# EasyEDA Pro project 小相机第一版.epro

# Schematic Schematic1
Assembly Variant: Basic; Board Name: Board1; Create Date: 2025-12-20; Page Name: P1; Project Name: 摄像头屏幕模块; Schematic Name: Schematic1; Update Date: 2025-12-20; BladeWidth: 10; Company: 嘉立创EDA; Page Size: A4; RegionStart: 1; ShowBorder: 1; TitleBlock: 1; TitleBlockPosition: 3; Version: V1.0; XRegionCount: 6; YRegionCount: 4
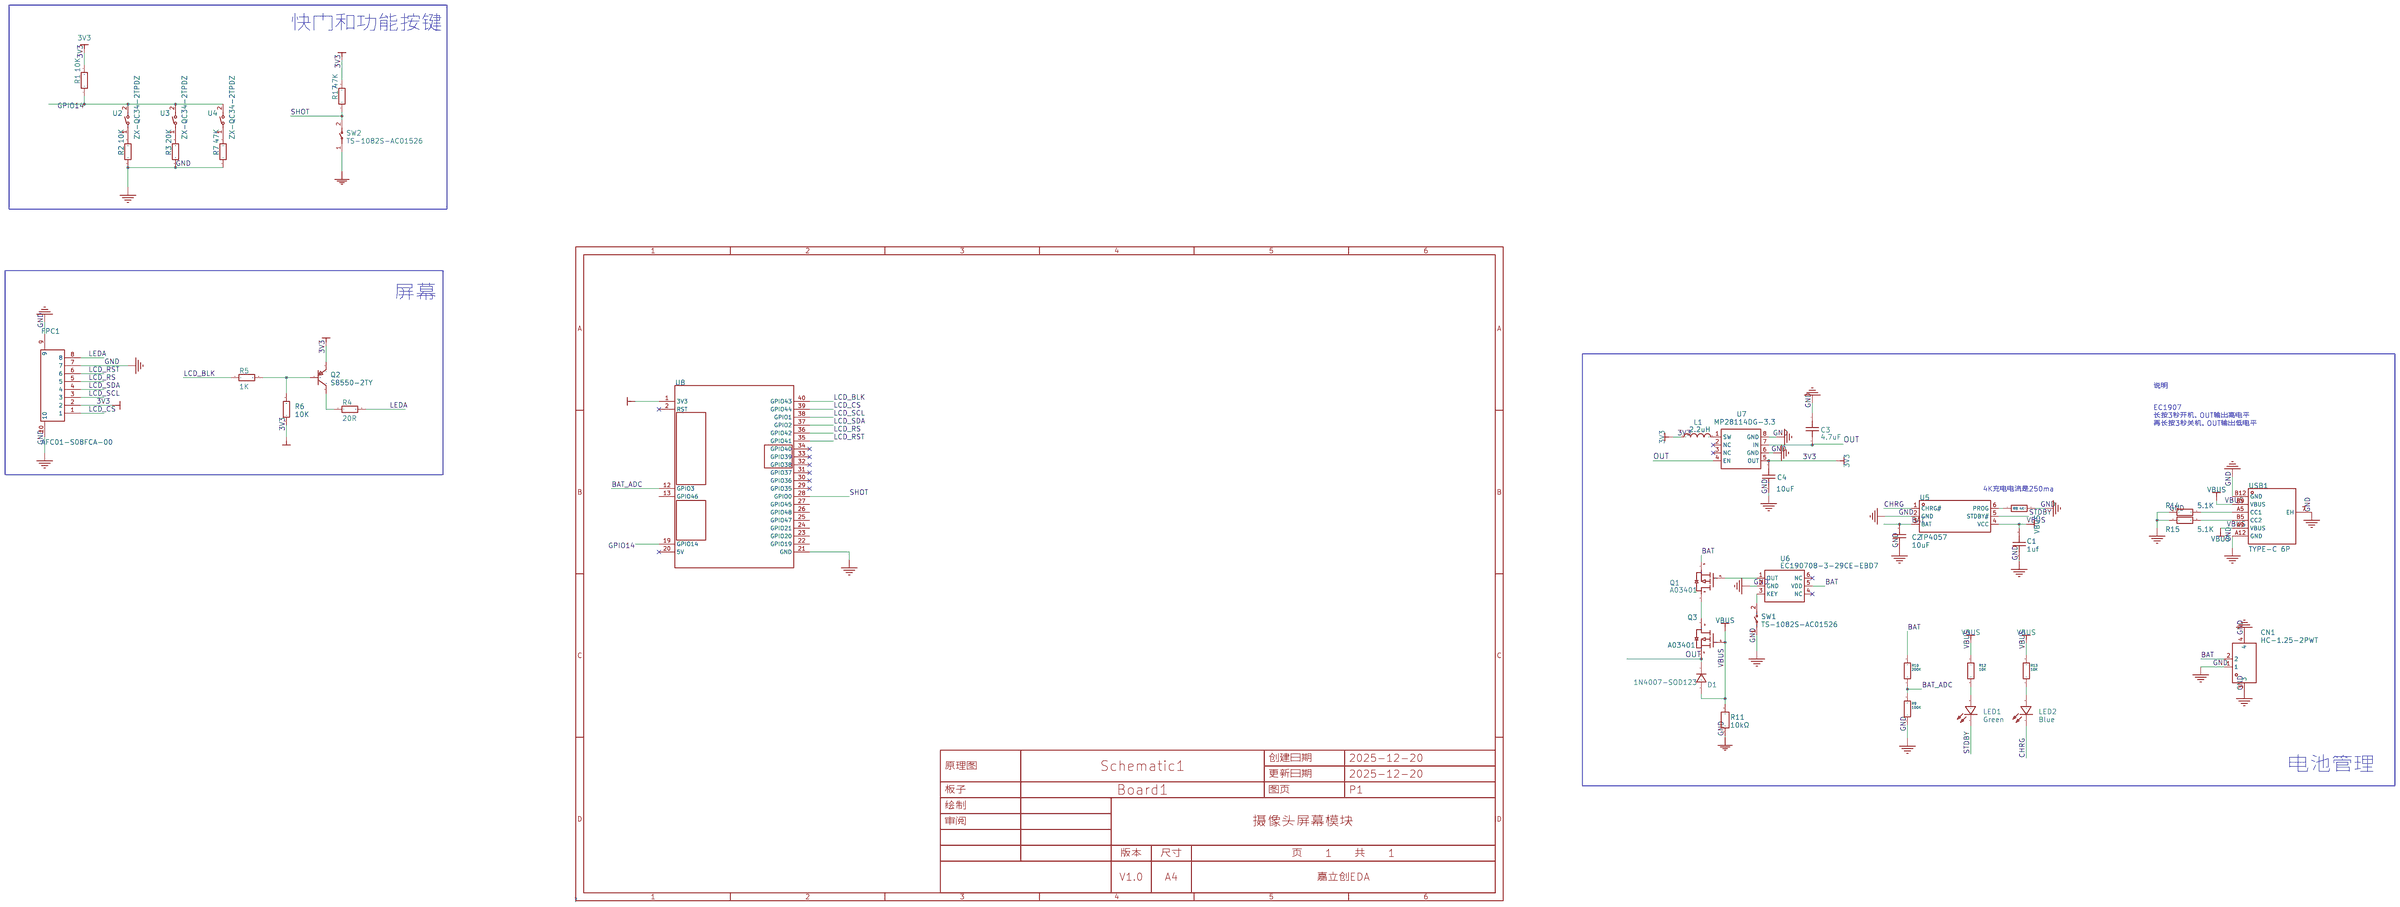
[diagram p0: schematic sheet]

## Parts
C1  1uf  [C0402]
C2  10uF  [C0402]
C3  4.7uF  [C0402]
C4  10uF  [C0402]
CN1  HC-1.25-2PWT  [CONN-SMD_2P-P1.25-HC-1.25-2PWT]
D1  1N4007-SOD123  [SOD-123FL_L2.8-W1.8-LS3.7-RD-1]
FPC1  AFC01-S08FCA-00  [FPC-SMD_P0.50-8P_FGS-XJ-H2.0]
L1  2.2uH  [L0402]
LED1  Green  [LED0603-RD]
LED2  Blue  [LED0603-RD]
Q1  A03401  [A03401]
Q2  S8550-2TY  [SOT-23-3_L2.9-W1.3-P0.95-LS2.4-BR]
Q3  A03401  [A03401]
R1  10K  [R0402]
R2  10K  [R0402]
R3  20K  [R0402]
R4  20R  [R0402]
R5  1K  [R0402]
R6  10K  [R0402]
R7  47K  [R0402]
R8  4K  [R0402]
R9  100K  [R0402]
R10  200K  [R0402]
R11  10kΩ  [R0402]
R12  10K  [R0402]
R13  10K  [R0402]
R14  5.1K  [R0402]
R15  5.1K  [R0402]
R17  47K  [R0402]
SW1  TS-1082S-AC01526  [SW-SMD_L3.9-W3.6-LS4.8-EH]
SW2  TS-1082S-AC01526  [SW-SMD_L3.9-W3.6-LS4.8-EH]
U2  ZX-QC34-2TPDZ  [KEY-SMD_L3.9-W3.0-LS5.0-EH]
U3  ZX-QC34-2TPDZ  [KEY-SMD_L3.9-W3.0-LS5.0-EH]
U4  ZX-QC34-2TPDZ  [KEY-SMD_L3.9-W3.0-LS5.0-EH]
U5  TP4057  [SOT-23-6_L2.9-W1.6-P0.95-LS2.8-BR]
U6  EC190708-3-29CE-EBD7  [SOT-23-6_L2.9-W1.6-P0.95-LS2.9-BL]
U7  MP28114DG-3.3  [MP28114DG-3.3]
U8  -  [esp32s3_cam模块]
USB1  TYPE-C 6P  [TYPE-C-SMD_TYPE-C-6P]

## Library data of the parts
C1 = CAP_0603: Supplier Footprint: 0603
C2 = CL05A106MQ5NUNC: 容值:10uF;精度:±20%;额定电压:6.3V;温度系数:X5R;; LCSC Part Name: 10uF ±20% 6.3V; Supplier Part: C15525; Manufacturer: SAMSUNG(三星); Supplier Footprint: 0402; JLCPCB Part Class: Basic Part; Datasheet: https://item.szlcsc.com/datasheet/CL05A106MQ5NUNC/16204.html; Supplier: LCSC; Tolerance: ±20%; Voltage Rating: 6.3V; Temperature Coefficient: X5R
C3 = 4.7uF: Supplier: LCSC; Supplier Part: C15415; Manufacturer: SAMSUNG(三星); Manufacturer Part: 1uF; JLCPCB Part Class: Extended Part; nameAlias: Value; Contributor: LCSC; spicePre: C; spiceSymbolName: 10UF
C4 = 10uF: Supplier: LCSC; Supplier Part: C15415; Manufacturer: SAMSUNG(三星); JLCPCB Part Class: Extended Part; nameAlias: Value; Contributor: LCSC; spicePre: C; spiceSymbolName: 10UF
CN1 = HC-1.25-2PWT: 插针结构:1x2P;间距:1.25mm;安装方式:卧贴;参考系列:PicoBlade(MX 1.25);总PIN数:2P;排数:1;每排PIN数:2;行距:-;额定电流:1A;触头材质:黄铜;触头镀层:锡;工作温度范围:-40℃~+105℃;; LCSC Part Name: 1x2P 间距:1.25mm 卧贴 系列:PicoBlade(MX 1.25); Supplier Part: C2845379; Manufacturer: HCTL(华灿天禄); Supplier Footprint: SMD,P=1.25mm,卧贴; JLCPCB Part Class: Extended Part; Datasheet: https://atta.szlcsc.com/upload/public/pdf/source/20240930/9508A8292CCC87B0C29E3A028D56E30A.pdf; Supplier: LCSC; Pins Structure: 1x2P; Pitch: 1.25mm; Mounting Style: 卧贴; Reference Series: PicoBlade(MX 1.25); Number of Pins: 2P; Number of Rows: 1; Number of PINs Per Row: 2; Current Rating (Max): 1A; Contact Material: 黄铜; Contact Plating: 锡; Operating Temperature Range: -40℃~+105℃; Rated Voltage (Max): 125V; Plastic Material: LCP; Flame Retardant Rating: UL94V-0; Supplementary Features: 辅助焊脚; Z-Height of the Board: 3.57mm; X-Length of Bottom Edge on Board (Spacing Line): 7.55mm; Y-Width of Bottom Edge on Board: 5.25mm
D1 = 1N4007-SOD123: Supplier: LCSC; Supplier Part: C9900003500; Manufacturer: null; Contributor: LCSC; spicePre: D
FPC1 = AFC01-S08FCA-00: 锁定特性:翻盖式;触点类型:下接;触点数量:8P;间距:0.5mm;安装方式:卧贴;; LCSC Part Name: 间距:0.5mm P数:8P 翻盖式 下接; Supplier Part: C262657; Manufacturer: JS(钜硕电子); Supplier Footprint: SMD,P=0.5mm,卧贴; JLCPCB Part Class: Extended Part; Datasheet: https://item.szlcsc.com/datasheet/AFC01-S08FCA-00/253916.html; Supplier: LCSC; Locking Feature: 翻盖式; Contact Type: 下接; Number of Contacts: 8P; Pitch: 0.5mm; Mounting Type: 卧贴; FFC, FCB Thickness: 0.3mm; Height Above Board: 2mm
L1 = 2.2uH: Supplier: LCSC; Supplier Part: C5349665; Manufacturer: APV(爱普微); Manufacturer Part: APH0420T2R2M; JLCPCB Part Class: Extended Part; Contributor: lcsc; nameAlias: Value; spicePre: L; spiceSymbolName: APH0420T2R2M
LED1 LED2 = NCD0603Y2: 发光颜色:黄色;正向电压(VF):1.6V~2.6V;功率:65mW;正向电流:20mA;主波长:586nm~595nm;透镜颜色:无色透明透镜;发光强度:100mcd~220mcd;发光角度:130°;工作温度:-30℃~+85℃;; Supplier Part: C89811; Manufacturer: 国星光电; Supplier Footprint: 0603; JLCPCB Part Class: Extended Part; Datasheet: https://atta.szlcsc.com/upload/public/pdf/source/20200820/C89811_7FE84B429B6BCA3E113B125EE1452576.pdf; Supplier: LCSC; Emitted Color: 黄色; Forward Voltage (VF): 1.6V~2.6V; Power Dissipation: 65mW; Forward Current: 20mA; Dominant Wavelength: 586nm~595nm; Lens Color: 无色透明透镜; Luminous Intensity: 100mcd~220mcd; Viewing Angle: 130°; Operating Temperature: -30℃~+85℃
Q1 = A03401: Contributor: shanggan; spicePre: Q
Q2 = S8550-2TY: 晶体管类型:PNP;集电极电流(Ic):500mA;集射极击穿电压(Vceo):25V;耗散功率(Pd):300mW;直流电流增益(hFE):120@50mA,1V;; Supplier Part: C364313; Manufacturer: MDD(辰达半导体); Supplier Footprint: SOT-23; JLCPCB Part Class: Extended Part; Datasheet: https://atta.szlcsc.com/upload/public/pdf/source/20241121/929C91E9FE84DD82662DA9EB9CD21AEF.pdf; Supplier: LCSC; type: PNP; Current - Collector(Ic): 500mA; Collector - Emitter Voltage VCEO: 25V; Pd - Power Dissipation: 300mW; DC Current Gain: 120@50mA,1V; Transition frequency(fT): 150MHz; Current - Collector Cutoff: 100nA; Vce Saturation(VCE(sat)): 600mV; Operating Temperature: -55℃~+150℃
Q3 = A03401_1: Contributor: shanggan; spicePre: Q
R1-R3 R7 R17 = Res_0603: Supplier Footprint: 0603
R4-R6 R8-R10 R12-R15 = Res_604: Supplier Footprint: 0603
R11 = 10kΩ: Supplier: LCSC; Supplier Part: C6125857; Manufacturer: Ohmite; Manufacturer Part: APC0603T10K0Z; JLCPCB Part Class: Extended Part; nameAlias: Value; Contributor: lcsc; spicePre: R; spiceSymbolName: APC0603T10K0Z
SW1 SW2 = TS-1082S-AC01526: 电路结构:单刀单掷;按钮形状:矩形按钮;作用力:2.6N;安装方式:卧贴;开关长度:3.9mm;开关宽度:2.9mm;开关高度:1.5mm;带支架:带支架;触点电流:50mA;额定电压:12V;工作寿命:10万次;; LCSC Part Name: 3.9*2.9*1.5mm 卧贴 轻触开关; Supplier Part: C720494; Manufacturer: XUNPU(讯普); Supplier Footprint: SMD,3.9x2.9mm; JLCPCB Part Class: Extended Part; Datasheet: https://item.szlcsc.com/datasheet/TS-1082S-AC01526/763501.html; Supplier: LCSC; Circuit: 单刀单掷; Actuator Style: 矩形按钮; Operating Force: 2.6N; Mounting Type: 卧贴; Length: 3.9mm; Width: 2.9mm; Switch Height: 1.5mm; with Bracket: 带支架; Contact Current: 50mA; Voltage Rating: 12V; Actuator/Cap Color: 黑色; Termination Style: SMD接片; Life: 10万次; Operating Temperature: -30℃~+80℃
U2-U4 = ZX-QC34-2TPDZ: 电路结构:单刀单掷;按钮形状:圆形按钮;作用力:2.6N;安装方式:立贴;开关长度:3mm;开关宽度:4mm;开关高度:2mm;带支架:不带支架;触点电流:50mA;额定电压:12V;工作寿命:10万次;; LCSC Part Name: 3*4*2贴片开关带柱; Supplier Part: C7470219; Manufacturer: Megastar(兆星); Supplier Footprint: SMD,4x3mm; JLCPCB Part Class: Extended Part; Datasheet: https://item.szlcsc.com/datasheet/ZX-QC34-2TPDZ/8519225.html; Supplier: LCSC; Circuit: 单刀单掷; Actuator Style: 圆形按钮; Operating Force: 2.6N; Mounting Type: 立贴; Length: 3mm; Width: 4mm; Switch Height: 2mm; with Bracket: 不带支架; Contact Current: 50mA; Voltage Rating: 12V; Actuator/Cap Color: 黑色; Termination Style: 鸥翼型; Life: 10万次; Operating Temperature: -30℃~+80℃
U5 = TP4057: 工作电压:4V~6.5V;最大充电电流:500mA;电池类型:锂离子;电池节数:1;; Supplier Part: C725791; Manufacturer: UMW(友台半导体); Supplier Footprint: SOT-23-6; JLCPCB Part Class: Extended Part; Datasheet: https://item.szlcsc.com/datasheet/TP4057/772194.html; Supplier: LCSC; The Chip Type: 充电芯片; Voltage - Supply: 4V~6.5V; Charge Current - Max: 500mA; Charging Saturation Voltage: 4.24V; Type of Battery: 锂离子; Number of Cells: 1; Operating Temperature: -40℃~+85℃; Battery Temperature Detection: 支持; Supply Current (Iq): 25uA
U6 = EC190708-3-29CE-EBD7: Supplier: LCSC; Supplier Part: C9900183753; Manufacturer: null; Contributor: lcsc; spicePre: U
U7 = MP28114DG-3.3: Contributor: httppp; spicePre: U
U8 = esp32s3_cam模块
USB1 = TYPE-C 6P: 连接器类型:Type-C;标准:USB 3.1;公母:母;安装方式:卧贴;触点数量:6P;端口数量:1;额定电流 - 电源:5A;工作温度范围:-40℃~+85℃;; LCSC Part Name: Type-C 母 卧贴; Supplier Part: C456012; Manufacturer: SHOU HAN(首韩); Supplier Footprint: SMD; JLCPCB Part Class: Extended Part; Datasheet: https://atta.szlcsc.com/upload/public/pdf/source/20201203/C456012_B13F72044DF846EDBE9BDD0D1D3CD166.pdf; Supplier: LCSC; Connector Type: Type-C; Standard: USB 3.1; Gender: 母; Mounting Style: 卧贴; Number of Contacts: 6P; Number of Ports: 1; Current Rating - Power (Max): 5A; Operating Temperature Range: -40℃~+85℃; Rated Voltage (Max): 20V; Connect-Disconnect Life: 3千次; Core Colour: 黑色

## Nets
3V3: C4.1 FPC1.2 L1.1 Q2.2(E) R1.2 R6.1 R17.2 U7.5(OUT) U8.1(3V3)
GND: C1.1 C2.1 C3.1 C4.2 CN1.1 CN1.3 CN1.4 FPC1.7 FPC1.9 FPC1.10 R2.1 R3.1 R7.1 R8.2 R9.1 R11.1 R14.1 R15.1 SW1.1 SW2.1 U5.2(GND) U6.2(GND) U7.6(GND) U7.8(GND) U8.21(GND) USB1.7(EH) USB1.A12(GND) USB1.B12(GND)
VBUS: C1.2 D1.2 Q3.1(G) R11.2 R12.1 R13.2 U5.4(VCC) USB1.A9(VBUS) USB1.B9(VBUS)
BAT: C2.2 CN1.2 Q1.2(S) R10.2 U5.3(BAT) U6.5(VDD)
BAT_ADC: R9.2 R10.1 U8.12(GPIO3)
CHRG: LED2.1(K) U5.1(CHRG#)
GPIO14: R1.1 U2.2 U3.2 U4.2 U8.19(GPIO14)
LCD_BLK: R5.1 U8.40(GPIO43)
LCD_CS: FPC1.1 U8.39(GPIO44)
LCD_RS: FPC1.5 U8.36(GPIO42)
LCD_RST: FPC1.6 U8.35(GPIO41)
LCD_SCL: FPC1.3 U8.38(GPIO1)
LCD_SDA: FPC1.4 U8.37(GPIO2)
LEDA: FPC1.8 R4.2
OUT: C3.2 D1.1 Q3.2(S) U7.4(EN) U7.7(IN)
SHOT: R17.1 SW2.2 U8.28(GPIO0)
STDBY: LED1.1(K) U5.5(STDBY#)
$1N30: Q2.3(C) R4.1
$1N32: Q2.1(B) R5.2 R6.2
$1N51: R2.2 U2.1
$1N52: R3.2 U3.1
$1N53: R7.2 U4.1
$1N119: R15.2 USB1.B5(CC2)
$1N120: R14.2 USB1.A5(CC1)
$1N124: LED2.2(A) R13.1
$1N126: LED1.2(A) R12.2
$1N130: Q1.3(D) Q3.3(D)
$1N146: SW1.2 U6.3(KEY)
$1N149: Q1.1(G) U6.1(OUT)
$1N157: R8.1 U5.6(PROG)
Net-(L1-2): L1.2 U7.1(SW)

Not connected (* = marked no-connect by the designer): U6 4(NC)* 6(NC)*; U7 2(NC)* 3(NC)*; U8 2(RST)* 13(GPIO46) 20(5V)* 22(GPIO19) 23(GPIO20) 24(GPIO21) 25(GPIO47) 26(GPIO48) 27(GPIO45) 29(GPIO35)* 30(GPIO36)* 31(GPIO37)* 32(GPIO38)* 33(GPIO39)* 34(GPIO40)*

## Notes on the sheet
- 快门和功能按键
- 屏幕
- 说明
- EC1907
  长按3秒开机，OUT输出高电平
  再长按3秒关机，OUT输出低电平
- 4K充电电流是250ma
- 电池管理

# Board PCB1
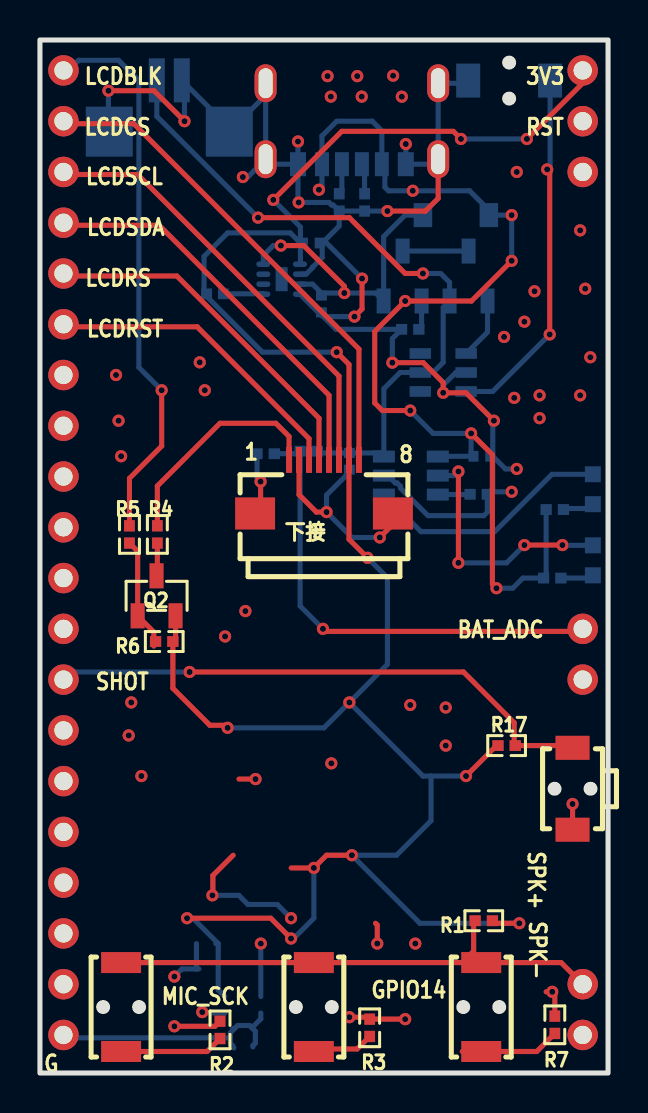
[diagram p1: board, top side]
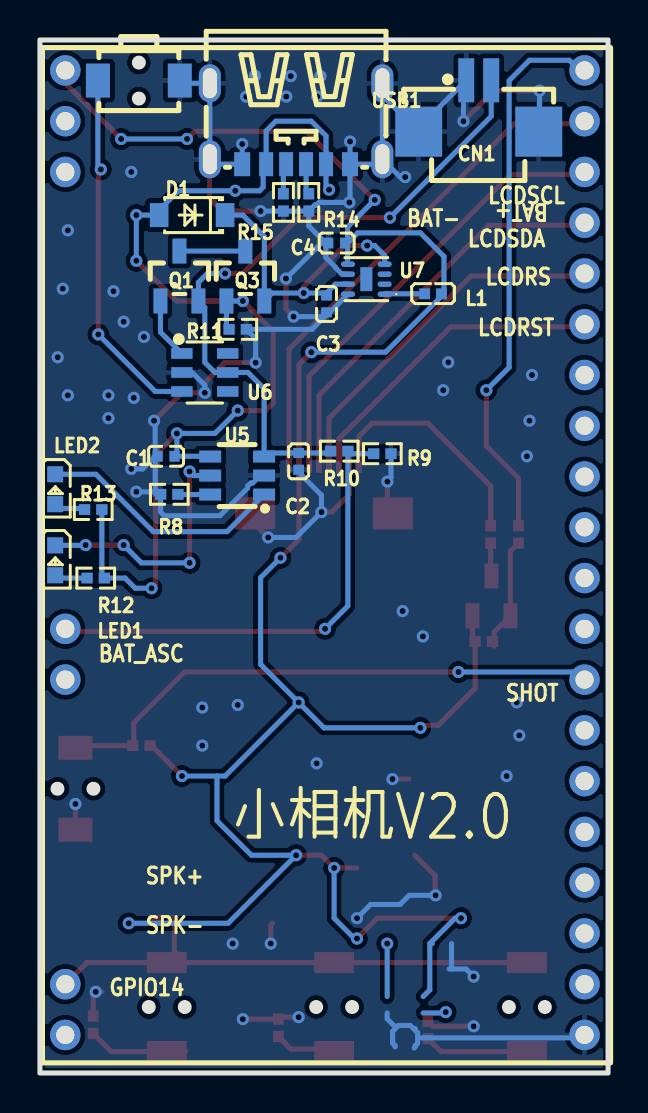
[diagram p2: board, bottom side, seen from below]

Outline 28.45 x 51.69 mm; copper layers: Top Layer, Bottom Layer. Coordinates in mm from the lower left corner of the outline.
Outline path: rectangle 0,51.69 28.45,0
Stack: Top Layer 0.035mm / Dielectric1 1.51mm FR4 er 4.5 / Bottom Layer 0.035mm

## Design rules (mm)
spacing copperThickness1oz (default): track to track 0.102, other pairs 0.152 to 0.3
spacing copperThickness2oz: track to track 0.203, other pairs 0.152 to 0.3
track width copperThickness1oz (default): min 0.127, default 0.254, max 2.54
track width copperThickness2oz: min 0.203, default 0.254, max 2.54
differential pair differentialPair (default): width min 0.127, default 0.254, max 2.54; gap min 0.152, default 0.152
net GND uses copperRegion

## Placement (name value [footprint] x y rotation side)
C1  1uf  [C0402]  22.13 30.86 180 bottom
C2  10uF  [C0402]  15.49 30.61 90 bottom
C3  4.7uF  [C0402]  14.1 38.48 90 bottom
C4  10uF  [C0402]  13.59 41.53 0 bottom
CN1  HC-1.25-2PWT  [CONN-SMD_2P-P1.25-HC-1.25-2PWT]  6.48 48.39 180 bottom
D1  1N4007-SOD123  [SOD-123FL_L2.8-W1.8-LS3.7-RD-1]  20.83 42.93 0 bottom
FPC1  AFC01-S08FCA-00  [FPC-SMD_P0.50-8P_FGS-XJ-H2.0]  14.22 29.34 180 top
L1  2.2uH  [L0402]  8.76 38.99 0 bottom
LED1  Green  [LED0603-RD]  27.69 25.65 270 bottom
LED2  Blue  [LED0603-RD]  27.69 29.21 270 bottom
Q1  -  [A03401]  21.46 39.88 180 bottom
Q2  S8550-2TY  [SOT-23-3_L2.9-W1.3-P0.95-LS2.4-BR]  5.84 23.88 270 top
Q3  -  [A03401]  18.16 39.88 180 bottom
R1  10K  [R0402]  22.22 7.62 0 top
R2  10K  [R0402]  9.02 2.16 270 top
R3  20K  [R0402]  16.51 2.26 270 top
R4  20R  [R0402]  5.88 26.95 90 top
R5  1K  [R0402]  4.48 26.95 270 top
R6  10K  [R0402]  6.22 21.59 180 top
R7  47K  [R0402]  25.78 2.41 270 top
R8  4K  [R0402]  21.97 28.96 0 bottom
R9  100K  [R0402]  11.3 30.99 0 bottom
R10  200K  [R0402]  13.46 31.11 0 bottom
R11  10kΩ  [R0402]  18.54 37.21 0 bottom
R12  10K  [R0402]  25.65 24.77 0 bottom
R13  10K  [R0402]  25.78 28.19 180 bottom
R14  5.1K  [R0402]  14.99 43.56 90 bottom
R15  5.1K  [R0402]  16.26 43.56 90 bottom
R17  47K  [R0402]  23.37 16.38 180 top
SW1  TS-1082S-AC01526  [SW-SMD_L3.9-W3.6-LS4.8-EH]  23.5 49.66 0 bottom
SW2  TS-1082S-AC01526  [SW-SMD_L3.9-W3.6-LS4.8-EH]  26.67 14.22 90 top
U2  ZX-QC34-2TPDZ  [KEY-SMD_L3.9-W3.0-LS5.0-EH]  4.06 3.3 90 top
U3  ZX-QC34-2TPDZ  [KEY-SMD_L3.9-W3.0-LS5.0-EH]  13.72 3.3 90 top
U4  ZX-QC34-2TPDZ  [KEY-SMD_L3.9-W3.0-LS5.0-EH]  22.1 3.3 90 top
U5  TP4057  [SOT-23-6_L2.9-W1.6-P0.95-LS2.8-BR]  18.57 29.89 180 bottom
U6  EC190708-3-29CE-EBD7  [SOT-23-6_L2.9-W1.6-P0.95-LS2.9-BL]  20.19 35.05 270 bottom
U7  -  [MP28114DG-3.3]  12.1 39.72 0 bottom
U8  -  [esp32s3_cam模块]  4.7 24 180 bottom
USB1  TYPE-C 6P  [TYPE-C-SMD_TYPE-C-6P]  15.62 47.5 0 bottom

## Footprints (pads in the part's own frame, mm; a bottom-side part is the same pattern mirrored in y, then rotated)
A03401
  rect 0.7x1.25 smd: 1(-0.95,-1.25) 2(0.95,-1.25) 3(0,1.25)
C0402
  rect 0.5x0.54 smd: 1(-0.42,0) 2(0.42,0)
CONN-SMD_2P-P1.25-HC-1.25-2PWT
  rect 0.8x2.2 smd: 1(-0.625,1.285) 2(0.625,1.285)
  rect 2.35x2.5 smd: 3(-3.005,-1.285) 4(3.005,-1.285)
esp32s3_cam模块
  round 1.524 hole 0.914: 1(-22.479,26.162) 2(-22.479,23.622) 3(-22.479,21.082) 12(-22.479,-1.778) 13(-22.479,-4.318) 19(-22.479,-19.558) 20(-22.479,-22.098) 21(3.521,-22.098) 22(3.521,-19.558) 23(3.521,-17.018) 24(3.521,-14.478) 25(3.521,-11.938) 26(3.521,-9.398) 27(3.521,-6.858) 28(3.521,-4.318) 29(3.521,-1.778) 30(3.521,0.762) 31(3.521,3.302) 32(3.521,5.842) 33(3.521,8.382) 34(3.521,10.922) 35(3.521,13.462) 36(3.521,16.002) 37(3.521,18.542) 38(3.521,21.082) 39(3.521,23.622) 40(3.521,26.162)
FPC-SMD_P0.50-8P_FGS-XJ-H2.0
  rect 0.3x1.3 smd: 1(-1.75,-1.34) 2(-1.252,-1.339) 3(-0.75,-1.34) 4(-0.25,-1.34) 5(0.25,-1.34) 6(0.75,-1.34) 7(1.25,-1.34) 8(1.75,-1.34)
  rect 2x1.6 smd: 9(3.45,1.34) 10(-3.45,1.34)
KEY-SMD_L3.9-W3.0-LS5.0-EH
  rect 1.05x2 smd: 1(-2.225,0) 2(2.225,0)
L0402
  rect 0.54x0.54 smd: 1(-0.42,0) 2(0.42,0)
LED0603-RD
  rect 0.8x0.8 smd: 1(-0.749,0) 2(0.749,0)
MP28114DG-3.3
  oval 0.705x0.28 smd: 1(-0.917,0.75) 2(-0.917,0.25) 3(-0.917,-0.25) 4(-0.917,-0.75) 5(0.917,-0.75) 6(0.917,-0.25) 7(0.917,0.25) 8(0.917,0.75)
  rect 0.6x1.2 smd: 9(0,0)
R0402
  rect 0.566x0.54 smd: 1(-0.433,0) 2(0.433,0)
SOD-123FL_L2.8-W1.8-LS3.7-RD-1
  rect 0.93x1.2 smd: 1(-1.65,0) 2(1.65,0)
SOT-23-3_L2.9-W1.3-P0.95-LS2.4-BR
  rect 1.25x0.7 smd: 1(1,-0.95) 2(1,0.95) 3(-1,0)
SOT-23-6_L2.9-W1.6-P0.95-LS2.8-BR
  rect 1.1x0.6 smd: 1(1.35,-0.95) 2(1.35,0) 3(1.35,0.95) 4(-1.35,0.95) 5(-1.35,0) 6(-1.35,-0.95)
SOT-23-6_L2.9-W1.6-P0.95-LS2.9-BL
  rect 0.532x1.072 smd: 1(-0.95,-1.149) 2(0,-1.149) 3(0.95,-1.149) 4(0.95,1.149) 5(0,1.149) 6(-0.95,1.149)
SW-SMD_L3.9-W3.6-LS4.8-EH
  rect 1.2x1.7 smd: 1(-2.05,0) 2(2.05,0)
TYPE-C-SMD_TYPE-C-6P
  oval 1.1x1.9 hole 0.7x1.5: 7(-4.32,-2.025) 7(-4.32,1.775) 7(4.32,-2.025) 7(4.32,1.775)
  rect 0.7x1.2 smd: A5(-0.5,2.025) A9(1.5,2.025) B5(0.5,2.025) B9(-1.5,2.025)
  rect 0.8x1.2 smd: A12(2.7,2.025) B12(-2.7,2.025)

## Nets
As in the schematic, except:
3V3: FPC1.2 Q2.2 R1.2 R6.1 R17.2 U7.5 U8.1
GND: C2.1 C4.1 CN1.1 CN1.3 CN1.4 FPC1.7 FPC1.9 FPC1.10 R2.1 R3.1 R7.1 R8.2 R9.1 R11.1 R14.1 R15.1 SW1.1 SW2.1 U5.2 U6.2 U7.6 U7.8 U8.21 USB1.7 USB1.A12 USB1.B12
VBUS: C1.1 D1.2 Q3.1 R11.2 R12.1 R13.2 U5.4 USB1.A9 USB1.B9
OUT: C3.1 D1.1 Q3.2 U7.4 U7.7

Pads without a net: C1 2; C3 2; C4 2; L1 1 2; U6 4 6; U7 2 3 9; U8 2 3 13 20 22 23 24 25 26 27 29 30 31 32 33 34

## Via types
v1: diameter 0.61, hole 0.305, Top Layer to Bottom Layer, 95 vias

## Routing (per net, layer and track width the routed paths; a pad name or vN(x,y) marks a point on that pad's centre or on a via; arc(x,y) is an arc through that point)
3V3: length 116.7
  Top Layer w0.254: v1(15.62,10.9) 14.35,10.9 v1(13.72,10.26) 12.58,10.26 ; v1(24,7.49) 22.78,7.49 22.66,7.62 ; v1(24.38,46.74) 27.31,49.66 27.31,50.04 ; v1(21.34,14.86) 22.86,16.38 R17.2 ; v1(21.08,46.74) 20.7,47.12 15.11,47.12 v1(11.68,43.69) ; v1(7.37,7.75) 11.56,7.75 v1(12.57,6.73) ; R6.1 6.66,19.25 8.51,17.4 9.27,17.4 v1(9.4,17.27) ; v1(16.4,25.78) 15.48,26.71 15.48,35.45 v1(14.86,36.07) ; Q2.2 6.79,21.59
  Bottom Layer w0.254: 13.04,41.53 13.04,42.33 v1(11.68,43.69) ; 13.04,41.53 12.54,42.04 9.4,42.04 8.22,40.86 8.22,38.99 11.14,36.07 v1(14.86,36.07) ; 13.04,41.53 13.04,40.49 U7.5 ; 9.26,3.83 8.93,4.16 8.93,6.48 ; 8.93,6.48 8.8,6.48 ; 8.93,6.48 7.66,7.75 v1(7.37,7.75) ; 19.58,14.86 v1(21.34,14.86) ; 19.58,14.86 19.58,12.62 17.86,10.9 v1(15.62,10.9) 19.03,7.49 v1(24,7.49) ; 19.58,14.86 19.18,14.86 v1(15.49,18.54) ; v1(24.38,46.74) v1(21.08,46.74) ; v1(16.4,25.78) 17.4,24.78 17.4,20.45 v1(15.49,18.54) ; v1(15.49,18.54) 14.22,17.27 v1(9.4,17.27) ; v1(13.72,10.26) 13.72,7.75 12.7,6.73 v1(12.57,6.73)
GND: length 127.8
  Top Layer w0.254: v1(15.49,2.79) 16.41,2.79 R3.1 v1(18.29,2.7) ; USB1.7 19.94,43.77 19.3,43.13 v1(17.4,43.13) ; v1(17.02,26.8) 17.67,27.45 FPC1.10 ; 16.8,7.49 16.89,7.41 v1(16.89,6.48) ; FPC1.7 12.97,28.94 13.84,28.07 v1(14.35,28.07) ; FPC1.9 11.05,28.27 v1(11.05,29.59) ; v1(3.43,49.15) 5.72,49.15 v1(7.24,47.62) ; 8.66,8.89 8.66,9.88 9.68,10.9 ; R2.1 8.76,2.34 v1(6.73,2.34) ; v1(15.75,37.85) 16.13,38.23 v1(16.13,39.75) ; 25.35,4.06 v1(25.65,4.06) 25.78,3.94 R7.1 ; 9.97,14.71 v1(10.8,14.71) ; v1(17.65,35.54) 19.19,35.54 20.19,34.54 v1(20.19,34.04) 21.34,34.04 v1(22.73,32.64) ; SW2.1 v1(26.67,13.46)
  Bottom Layer w0.254: 9.71,1.25 9.66,1.31 9.66,1.37 9.53,1.49 9.53,1.76 ; 7.84,5.21 7.11,5.21 v1(6.73,4.83) ; 7.84,5.21 7.96,5.21 ; 7.84,5.21 7.84,6.48 ; 10.61,2.26 10.5,2.38 9.9,2.38 9.73,2.21 9.66,2.21 9.66,2.14 9.53,2.01 9.53,1.76 ; 10.61,2.26 11.06,2.71 11.06,3 ; 10.61,2.26 10.79,2.09 10.79,1.49 10.67,1.37 10.67,1.31 ; USB1.B12 v1(12.92,46.61) ; USB1.B12 11.55,45.47 USB1.7 ; USB1.B12 12.92,43.59 v1(12.95,43.56) 14.47,43.56 14.6,43.43 14.68,43.43 R14.1 ; 7.24,49.53 9.48,47.29 CN1.3 11.3,48.92 ; 7.24,49.53 v1(7.24,47.62) ; 7.24,49.53 CN1.1 ; v1(17.4,43.13) R15.1 R14.1 ; CN1.4 3.43,47.14 v1(3.43,49.15) ; 22.68,30.86 22.68,32.66 22.69,32.64 v1(22.73,32.64) ; 22.68,30.86 23.31,30.23 v1(23.88,30.23) ; 22.68,30.86 22.68,29.23 R8.2 ; 9.53,1.76 1.32,1.76 1.31,1.78 ; 11.3,48.92 11.3,49.52 ; 11.3,48.92 USB1.7 ; U7.6 13.33,39.97 13.65,40.3 13.65,40.32 14.13,40.8 14.13,41.53 ; v1(18.32,46.48) USB1.A12 19.69,45.47 USB1.7 19.94,49.52 21.31,49.52 SW1.1 ; 14.13,41.53 14.99,42.38 R14.1 ; 14.13,41.53 14.35,41.53 v1(16.13,39.75) ; R8.2 22.4,28.07 22.22,27.89 19.43,27.89 18.05,29.27 18.05,29.36 17.89,29.52 17.8,29.52 17.42,29.89 U5.2 17.18,29.94 ; R8.2 22.61,28.96 22.73,29.08 v1(23.62,29.08) ; v1(10.16,44.83) 10.41,44.83 USB1.7 ; v1(17.65,35.54) 17.65,36.75 R11.1 14.82,37.21 14.19,37.85 ; 14.19,37.85 14.1,37.94 14.06,37.94 U7.8 ; 14.19,37.85 v1(15.75,37.85) ; v1(20.19,34.04) 20.19,34.42 20.83,35.05 U6.2 ; v1(17.02,26.8) 15.62,26.8 v1(14.35,28.07) 14.35,28.92 15.37,29.94 ; 8.66,8.89 9.96,8.89 10.41,8.43 11.89,8.43 v1(12.57,7.75) ; v1(11.05,29.59) 10.87,29.77 R9.1
  vias: v1(3.81,34.92) v1(3.94,32.64) v1(4.06,30.86) v1(4.45,16.89) v1(4.57,18.54) v1(5.08,14.86) v1(8,35.56) v1(8.25,34.16) v1(8.64,8.89) v1(9.27,21.84) v1(10.29,23.11) v1(14.4,49.88) v1(14.56,48.86) v1(14.59,15.49) v1(15.89,49.88) v1(16.11,48.86) v1(17.68,49.9) v1(18.12,48.85) v1(18.54,18.41) v1(18.8,6.48) v1(20.32,18.29) v1(20.32,16.38) v1(23.24,36.83) v1(23.75,33.78) v1(23.88,45.08) v1(24.26,37.59) v1(24.77,39.12) v1(25.02,33.91) v1(25.02,32.77) v1(27.05,42.16) v1(27.05,33.91) v1(27.31,39.24) v1(27.56,35.81)
VBUS: length 55.4
  Top Layer w0.254: v1(23.62,40.64) 21.61,38.63 v1(18.29,38.63) 16.76,37.1 16.76,33.53 17.15,33.15 v1(18.54,33.15) ; v1(21.59,32) 22.66,30.94 22.66,24.46 v1(22.86,24.26)
  Bottom Layer w0.254: U5.4 19.94,30.86 21.59,30.86 21.59,30.86 v1(21.59,32) 19.69,32 v1(18.54,33.15) ; v1(13.97,44.2) 14.12,44.35 USB1.B9 14.12,46.89 14.86,47.62 16.64,47.62 17.12,47.14 USB1.A9 17.27,45.32 17.27,44.32 17.45,44.14 v1(18.67,44.14) 21.52,44.14 22.48,43.18 D1.2 v1(23.62,42.93) v1(23.62,40.64) ; R13.2 25.35,24.77 24.18,24.77 23.67,24.26 v1(22.86,24.26) ; v1(18.29,38.63) Q3.1 19.11,37.35 R11.2
BAT: length 34.4
  Top Layer w0.254: v1(19.18,40) 18.29,40 15.49,42.8 v1(10.92,42.8)
  Bottom Layer w0.254: v1(10.92,42.8) 5.85,47.87 CN1.2 ; v1(19.18,40) 20.07,40 20.51,39.56 Q1.2 20.19,38.31 20.19,35.56 19.69,35.05 U6.5 18.03,35.05 17.22,34.24 U5.3 17.04,31.03 C2.2 13.98,31.03 R10.2
BAT_ADC: length 23.9
  Top Layer w0.254: v1(14.17,22.22) 14.3,22.1 27.31,22.1
  Bottom Layer w0.254: R9.2 12.9,30.99 R10.1 13.03,23.37 v1(14.17,22.22)
CHRG: length 12.4
  Bottom Layer w0.254: U5.1 19.08,27.09 22.77,27.09 25.64,29.96 LED2.1
GPIO14: length 25.3
  Top Layer w0.254: 4.95,5.53 13.34,5.53 13.57,5.3 13.86,5.3 14.09,5.53 21.15,5.53 ; 21.15,5.53 21.72,6.1 21.72,7.57 ; 21.15,5.53 26.1,5.53 27.31,4.32
LCD_BLK: length 27.7
  Top Layer w0.254: R5.1 4.48,29.76 6.1,31.37 v1(6.1,34.16)
  Bottom Layer w0.254: 1.31,50.04 1.94,50.67 3.94,50.67 4.95,49.66 4.95,35.31 v1(6.1,34.16)
LCD_CS: length 24.9
  Top Layer w0.254: 1.31,47.5 4.7,47.5 15.97,36.22 FPC1.1
LCD_RS: length 17.7
  Top Layer w0.254: 1.31,39.88 6.86,39.88 13.97,32.76 FPC1.5
LCD_RST: length 15.5
  Top Layer w0.254: 1.31,37.34 7.87,37.34 13.47,31.74 FPC1.6
LCD_SCL: length 22
  Top Layer w0.254: FPC1.3 14.97,34.87 4.89,44.96 1.31,44.96
LCD_SDA: length 19.9
  Top Layer w0.254: 1.31,42.42 5.97,42.42 14.48,33.91 14.48,30.68 FPC1.4
LEDA: length 11.3
  Top Layer w0.254: FPC1.8 12.47,31.85 11.81,32.51 9.02,32.51 5.88,29.37 R4.2
MIC_SCK: length 1.2
  Bottom Layer w0.254: v1(8.13,3.05) 8.17,3 9.26,3
MIC_WS: length 2.7
  Bottom Layer w0.254: 11.06,3.83 v1(11.06,6.48)
OUT: length 16.1
  Top Layer w0.254: v1(15.24,39.03) 15.24,39.37 13.21,41.4 v1(12.06,41.4)
  Bottom Layer w0.254: D1.1 18.29,42.93 17.21,41.85 Q3.2 16.81,39.03 v1(15.24,39.03) 14.1,39.03 13.65,39.47 U7.7 ; v1(12.06,41.4) 11.68,41.4 11.19,40.9 U7.4
SHOT: length 27.8
  Top Layer w0.254: SW2.2 26.56,16.38 R17.1 23.75,16.44 23.75,17.53 21.21,20.07 v1(7.49,20.07)
  Bottom Layer w0.254: 1.31,19.56 1.81,20.07 v1(7.49,20.07)
STDBY: length 12.8
  Top Layer w0.254: v1(20.96,30.1) v1(20.96,25.53) ; v1(26.16,26.42) v1(24.26,26.42)
  Bottom Layer w0.254: v1(24.26,26.42) 23.37,25.53 v1(20.96,25.53) ; v1(20.96,30.1) 20.75,29.89 U5.5 ; v1(26.16,26.42) 26.18,26.4 LED1.1
$1N30: length 1.6
  Top Layer w0.254: R4.1 5.88,24.91
$1N32: length 5.7
  Top Layer w0.254: R5.2 4.89,26.11 4.89,22.88 5.7,22.07 5.7,21.36
$1N51: length 4.3
  Top Layer w0.254: 4.95,1.08 8.37,1.08 R2.2
$1N52: length 3.1
  Top Layer w0.254: 13.72,1.2 15.88,1.2 R3.2
$1N53: length 5
  Top Layer w0.254: R7.2 24.88,1.08 21.15,1.08
$1N119: length 1.5
  Bottom Layer w0.254: R15.2 16.26,45.34 USB1.B5
$1N120: length 1.5
  Bottom Layer w0.254: R14.2 15.12,44.13 USB1.A5
$1N124: length 1.6
  Bottom Layer w0.254: 26.16,28.25 27.47,28.25 LED2.2
$1N126: length 1.7
  Bottom Layer w0.254: R12.2 27.55,24.77 LED1.2
$1N130: length 3.3
  Bottom Layer w0.254: Q3.3 Q1.3
$1N146: length 18.2
  Top Layer w0.254: v1(25.53,36.96) 25.53,45.08 v1(25.4,45.21)
  Bottom Layer w0.254: U6.3 22.67,34.1 v1(25.53,36.96) ; SW1.2 25.55,45.36 v1(25.4,45.21)
$1N148: length 1.9
  Bottom Layer w0.254: U7.1 11.17,38.99 9.31,38.99
$1N149: length 3.1
  Bottom Layer w0.254: U6.1 22.41,37.07 Q1.1
$1N157: length 1.6
  Bottom Layer w0.254: R8.1 21.53,28.94 U5.6

## Copper pours and planes (outline as drawn; the poured copper is in the pictures)
GND on Top Layer: 0,51.69 28.45,51.69 28.45,0 0,0
GND on Top Layer: 0,51.88 28.45,51.88 28.45,0 0,0
GND on Top Layer: 0,51.69 28.45,51.69 28.45,0 0,0
GND on Top Layer: 0,51.69 28.45,51.69 28.45,0 0,0
GND on Bottom Layer: 0,51.69 28.45,51.69 28.45,0 0,0
GND on Bottom Layer: 0,51.69 28.45,51.69 28.45,0 0,0
GND on Bottom Layer: 0,51.69 28.45,51.69 28.45,0 0,0
GND on Bottom Layer: 0,51.69 28.45,51.69 28.45,0 0,0
GND on Bottom Layer: 0,51.69 28.45,51.69 28.45,0 0,0

## Text on the board
Bottom Silkscreen Layer: BAT+ | SHOT | LCDSCL | LCDRS | LCDRST | LCDSDA | BAT- | SPK- | SPK+ | GPIO14 | BAT_ASC | 小相机V2.0
Top Silkscreen Layer: G | LCDBLK | LCDCS | LCDRS | LCDSCL | LCDRST | LCDSDA | SHOT | MIC_SCK | 1 | GPIO14 | 8 | BAT_ADC | 3V3 | RST | SPK+ | SPK- | 下接
